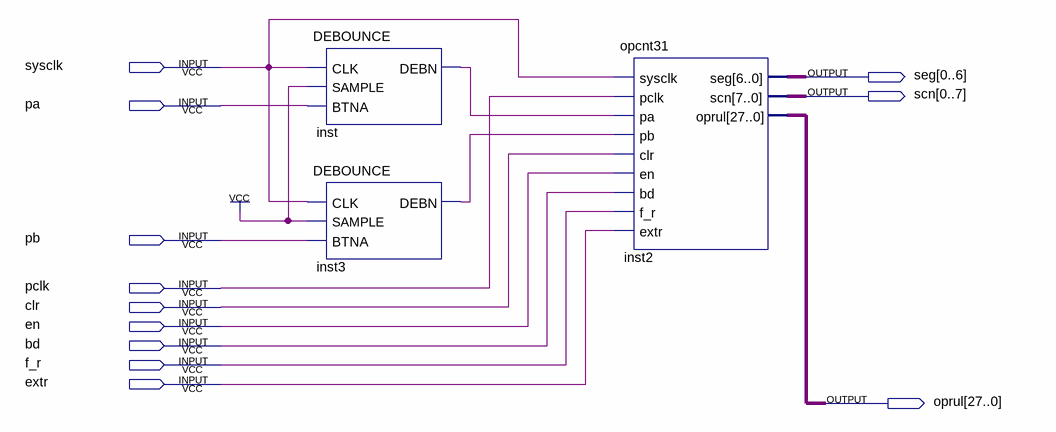
[diagram p0: schematic sheet]
// Quartus schematic opcnt31p.bdf as structural Verilog: 3 symbols, 12 pins
module opcnt31p (
  input  sysclk,
  input  pa,
  input  pb,
  input  pclk,
  input  clr,
  input  en,
  input  bd,
  input  f_r,
  input  extr,
  output [0:6] seg,
  output [0:7] scn,
  output [27:0] oprul
);

  wire inst3_debn, inst_debn;

  DEBOUNCE inst (.CLK(sysclk), .SAMPLE(1'b1), .BTNA(pa), .DEBN(inst_debn));
  DEBOUNCE inst3 (.CLK(sysclk), .SAMPLE(1'b1), .BTNA(pb), .DEBN(inst3_debn));
  opcnt31 inst2 (
    .sysclk(sysclk), .pclk(pclk), .pa(inst_debn), .pb(inst3_debn), .clr(clr), .en(en), .bd(bd), .f_r(f_r),
    .extr(extr), .seg(seg), .scn(scn), .oprul(oprul));
endmodule
